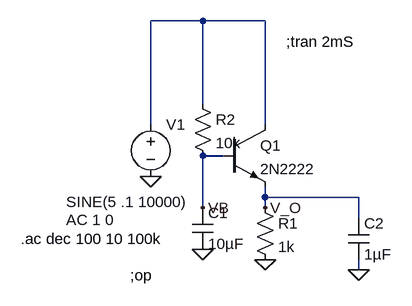
[diagram p0: schematic Smoother Circuitasc.asc]
Smoother Circuitasc.asc, the LTspice schematic file:
Version 4
SHEET 1 880 680
WIRE 128 -32 48 -32
WIRE 224 -32 128 -32
WIRE 128 96 128 -32
WIRE 48 128 48 -32
WIRE 224 128 224 -32
WIRE 160 176 128 176
WIRE 224 240 224 224
WIRE 368 240 224 240
WIRE 128 256 128 176
WIRE 224 256 224 240
WIRE 368 272 368 240
WIRE 368 352 368 336
FLAG 224 336 0
FLAG 48 208 0
FLAG 224 256 V_O
FLAG 128 256 VB
FLAG 128 320 0
FLAG 368 352 0
SYMBOL npn 160 128 R0
SYMATTR InstName Q1
SYMATTR Value 2N2222
SYMBOL voltage 48 112 R0
WINDOW 3 -130 135 Left 2
WINDOW 123 -130 163 Left 2
WINDOW 39 0 0 Left 0
SYMATTR Value SINE(5 .1 10000)
SYMATTR Value2 AC 1 0
SYMATTR InstName V1
SYMBOL res 208 240 R0
SYMATTR InstName R1
SYMATTR Value 1k
SYMBOL res 112 80 R0
SYMATTR InstName R2
SYMATTR Value 10k
SYMBOL cap 112 256 R0
SYMATTR InstName C1
SYMATTR Value 10µF
SYMBOL cap 352 272 R0
SYMATTR InstName C2
SYMATTR Value 1µF
TEXT 16 360 Left 2 !;op
TEXT 256 0 Left 2 !;tran 2mS
TEXT -152 304 Left 2 !.ac dec 100 10 100k

The netlist it stands for:
* Smoother Circuitasc.asc
Q1 N001 VB V_O 0 2N2222
V1 N001 0 SINE(5 .1 10000) AC 1 0
R1 V_O 0 1k
R2 N001 VB 10k
C1 VB 0 10µF
C2 V_O 0 1µF
.model NPN NPN
.model PNP PNP
.lib standard.bjt
;op
;tran 2mS
.ac dec 100 10 100k
.backanno
.end